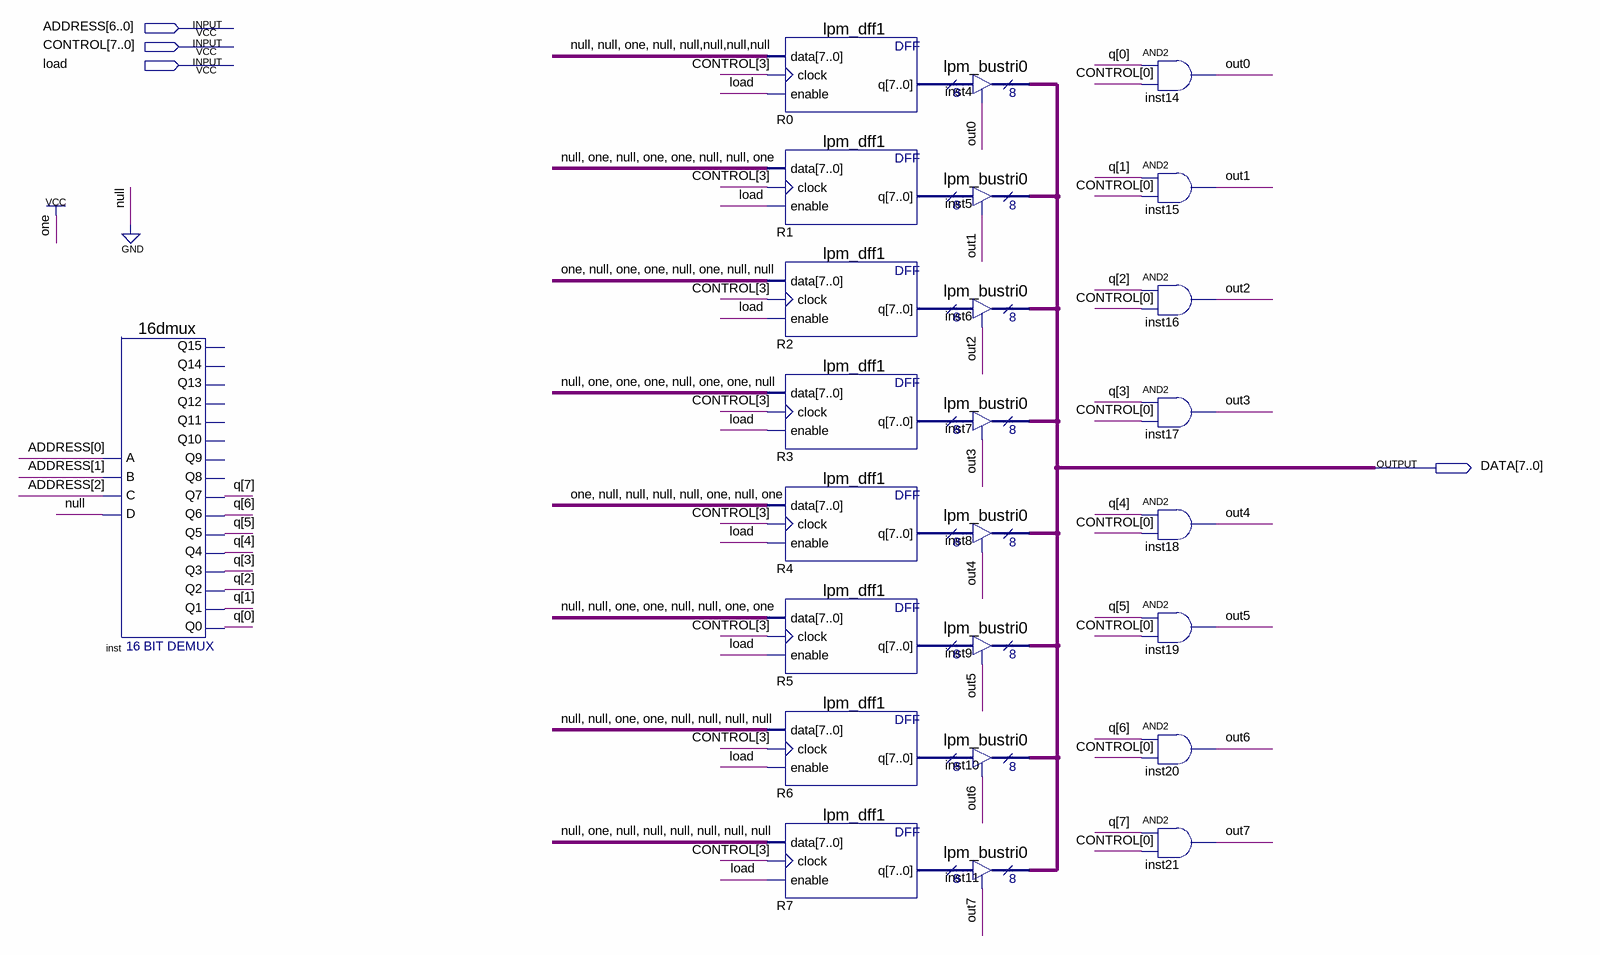
[diagram p0: schematic sheet]
// Quartus schematic GPR.bdf as structural Verilog: 25 symbols, 4 pins
module GPR (
  input  [6:0] ADDRESS,
  input  [7:0] CONTROL,
  input  load,
  output [7:0] DATA
);

  wire out0, out1, out2, out3, out4, out5, out6, out7;
  wire [7:0] q, R0_q, R1_q, R2_q, R3_q, R4_q, R5_q, R6_q, R7_q;

  \16dmux  inst (
    .C(ADDRESS[2]), .B(ADDRESS[1]), .A(ADDRESS[0]), .D(1'b0), .Q7(q[7]), .Q4(q[4]), .Q5(q[5]), .Q6(q[6]),
    .Q2(q[2]), .Q3(q[3]), .Q0(q[0]), .Q1(q[1]));  // open: Q12, Q13, Q11, Q9, Q10, Q8, Q14, Q15
  lpm_dff1 R0 (.data(8'b00100000), .clock(CONTROL[3]), .enable(load), .q(R0_q));
  lpm_dff1 R1 (.data(8'b01011001), .clock(CONTROL[3]), .enable(load), .q(R1_q));
  lpm_dff1 R2 (.data(8'b10110100), .clock(CONTROL[3]), .enable(load), .q(R2_q));
  lpm_dff1 R3 (.data(8'b01110110), .clock(CONTROL[3]), .enable(load), .q(R3_q));
  lpm_dff1 R4 (.data(8'b10000101), .clock(CONTROL[3]), .enable(load), .q(R4_q));
  lpm_dff1 R5 (.data(8'b00110011), .clock(CONTROL[3]), .enable(load), .q(R5_q));
  lpm_dff1 R6 (.data(8'b00110000), .clock(CONTROL[3]), .enable(load), .q(R6_q));
  lpm_dff1 R7 (.data(8'b01000000), .clock(CONTROL[3]), .enable(load), .q(R7_q));
  lpm_bustri0 inst4 (.enabledt(out0), .data(R0_q), .tridata(DATA));
  lpm_bustri0 inst5 (.enabledt(out1), .data(R1_q), .tridata(DATA));
  lpm_bustri0 inst6 (.enabledt(out2), .data(R2_q), .tridata(DATA));
  lpm_bustri0 inst7 (.enabledt(out3), .data(R3_q), .tridata(DATA));
  lpm_bustri0 inst8 (.enabledt(out4), .data(R4_q), .tridata(DATA));
  lpm_bustri0 inst9 (.enabledt(out5), .data(R5_q), .tridata(DATA));
  lpm_bustri0 inst10 (.enabledt(out6), .data(R6_q), .tridata(DATA));
  lpm_bustri0 inst11 (.enabledt(out7), .data(R7_q), .tridata(DATA));
  and inst14 (out0, q[0], CONTROL[0]);
  and inst15 (out1, q[1], CONTROL[0]);
  and inst16 (out2, q[2], CONTROL[0]);
  and inst17 (out3, q[3], CONTROL[0]);
  and inst18 (out4, q[4], CONTROL[0]);
  and inst19 (out5, q[5], CONTROL[0]);
  and inst20 (out6, q[6], CONTROL[0]);
  and inst21 (out7, q[7], CONTROL[0]);
endmodule
